# EAGLE design muses72320 (EAGLE 7.2.0)
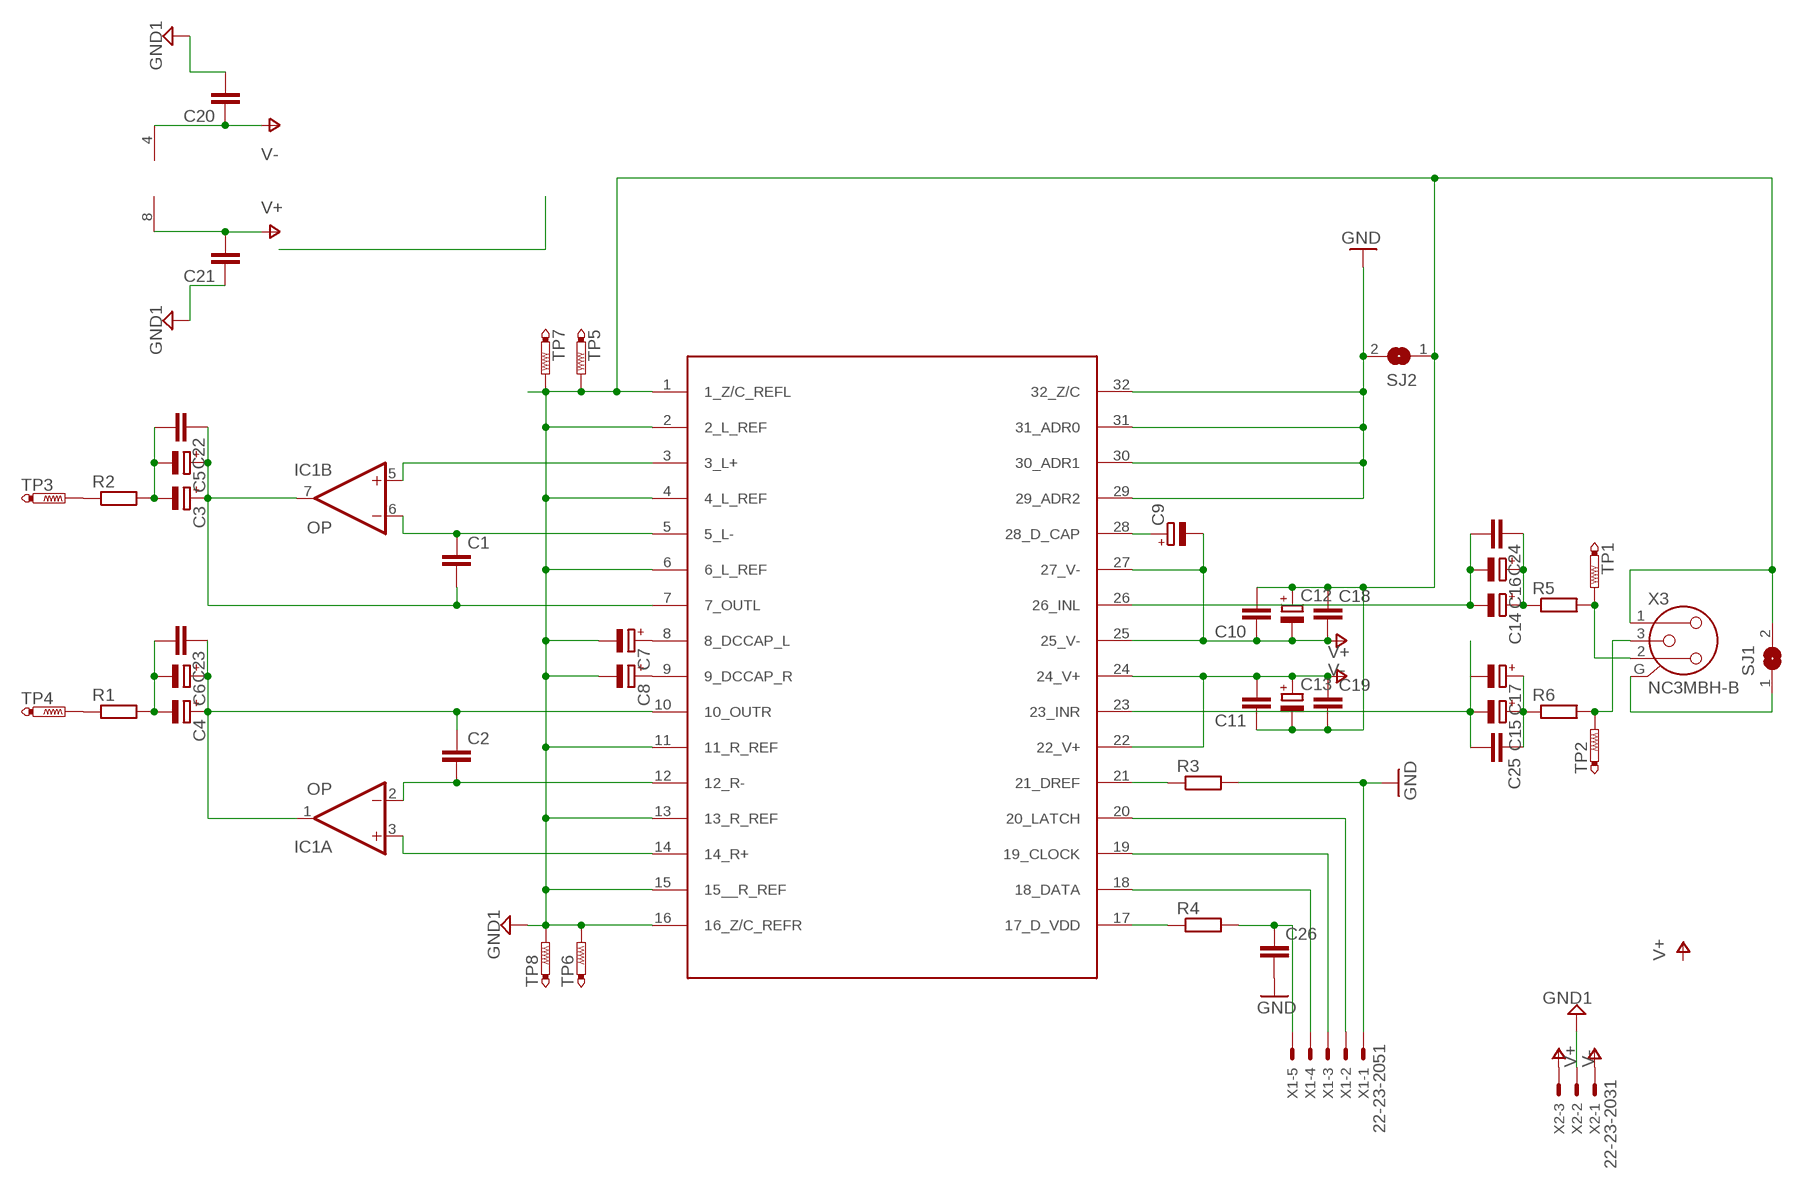
[diagram p0: schematic, sheet 1]

## Parts
C1  C-EU075-032X103  [C075-032X103]
C2  C-EU075-032X103  [C075-032X103]
C3  CPOL-EUE5-10.5  [E5-10,5]
C4  CPOL-EUE5-10.5  [E5-10,5]
C5  CPOL-EUE3.5-8  [E3,5-8]
C6  CPOL-EUE3.5-8  [E3,5-8]
C7  CPOL-EUE5-8.5  [E5-8,5]
C8  CPOL-EUE5-8.5  [E5-8,5]
C9  CPOL-EUE3.5-8  [E3,5-8]
C10  C-EU050-050X075  [C050-050X075]
C11  C-EU050-050X075  [C050-050X075]
C12  CPOL-EUE5-10.5  [E5-10,5]
C13  CPOL-EUE5-10.5  [E5-10,5]
C14  CPOL-EUE3.5-8  [E3,5-8]
C15  CPOL-EUE3.5-8  [E3,5-8]
C16  CPOL-EUE5-10.5  [E5-10,5]
C17  CPOL-EUE5-10.5  [E5-10,5]
C18  C-EU025-030X050  [C025-030X050]
C19  C-EU025-030X050  [C025-030X050]
C20  C-EU050-050X075  [C050-050X075]
C21  C-EU050-050X075  [C050-050X075]
C22  C-EU050-050X075  [C050-050X075]
C23  C-EU050-050X075  [C050-050X075]
C24  C-EU050-050X075  [C050-050X075]
C25  C-EU050-050X075  [C050-050X075]
C26  C-EUC1206  [C1206]
IC1  OP  LM4558N  [DIL08]
R1  R-EU_0207/7  [0207/7]
R2  R-EU_0207/7  [0207/7]
R3  R-EU_R1206  [R1206]
R4  R-EU_R1206  [R1206]
R5  R-EU_0207/7  [0207/7]
R6  R-EU_0207/7  [0207/7]
SJ1  SJ  [SJ]
SJ2  SJ  [SJ]
TP1  PTR1PAD1-20  [P1-20]
TP2  PTR1PAD1-20  [P1-20]
TP3  PTR1PAD1-20  [P1-20]
TP4  PTR1PAD1-20  [P1-20]
TP5  PTR1PAD1-20  [P1-20]
TP6  PTR1PAD1-20  [P1-20]
TP7  PTR1PAD1-20  [P1-20]
TP8  PTR1PAD1-20  [P1-20]
U$1  MUSES72320  [SSOP28DB]
X1  22-23-2051  [22-23-2051]
X2  22-23-2031  [22-23-2031]
X3  NC3MBH-B  [NC3MBH-B]

## Nets
CLOCK: U$1.19(19_CLOCK) X1.3
DATA: U$1.18(18_DATA) X1.4
GND: C26.2 R3.2 SJ2.2 U$1.29(29_ADR2) U$1.30(30_ADR1) U$1.31(31_ADR0) U$1.32(32_Z/C) X1.1
GND1: C7.- C8.- C10.2 C11.1 C12.+ C13.- C18.1 C19.2 C20.2 C21.1 SJ1.2 SJ2.1 TP5.TP TP6.TP TP7.TP TP8.TP U$1.1(1_Z/C_REFL) U$1.2(2_L_REF) U$1.4(4_L_REF) U$1.6(6_L_REF) U$1.11(11_R_REF) U$1.13(13_R_REF) U$1.15(15__R_REF) U$1.16(16_Z/C_REFR) X2.2 X3.1
LATCH: U$1.20(20_LATCH) X1.2
N$2: IC1.3(A:+IN) U$1.14(14_R+)
N$3: C2.2 IC1.2(A:-IN) U$1.12(12_R-)
N$4: C1.1 IC1.6(B:-IN) U$1.5(5_L-)
N$5: IC1.5(B:+IN) U$1.3(3_L+)
N$6: C1.2 C3.+ C5.+ C22.1 IC1.7(B:OUT) U$1.7(7_OUTL)
N$7: C2.1 C4.+ C6.+ C23.1 IC1.1(A:OUT) U$1.10(10_OUTR)
N$8: C3.- C5.- C22.2 R2.2
N$9: C4.- C6.- C23.2 R1.2
N$10: C7.+ U$1.8(8_DCCAP_L)
N$11: C8.+ U$1.9(9_DCCAP_R)
N$12: SJ1.1 X3.G
N$13: R5.2 TP1.TP X3.2
N$14: R6.2 TP2.TP X3.3
N$15: R3.1 U$1.21(21_DREF)
N$16: R4.1 U$1.17(17_D_VDD)
N$17: C9.+ U$1.28(28_D_CAP)
N$19: R2.1 TP3.TP
N$20: R1.1 TP4.TP
N$21: C26.1 R4.2 X1.5
N$23: C15.- C17.- C25.2 U$1.23(23_INR)
N$24: C14.- C16.- C24.2 U$1.26(26_INL)
N$25: C14.+ C16.+ C24.1 R5.1
N$26: C15.+ C17.+ C25.1 R6.1
V+: C11.2 C13.+ C19.1 C21.2 IC1.8(P:V+) U$1.22(22_V+) U$1.24(24_V+) X2.1
V-: C9.- C10.1 C12.- C18.2 C20.1 IC1.4(P:V-) U$1.25(25_V-) U$1.27(27_V-) X2.3

## Library data of the parts
C1 C2 C10 C11 C18-C26 = Vwvwbg:C-EU: CAPACITOR, European symbol
C3-C9 C12-C17 = Vwvwbg:CPOL-EU: POLARIZED CAPACITOR, European symbol
IC1 = linear:*4558: OP AMP
R1-R6 = Vwvwbg:R-EU_: RESISTOR, European symbol
SJ1 SJ2 = jumper:SJ: SMD solder JUMPER
TP1-TP8 = testpad:PTR1: TEST PIN
U$1 = Vwvwbg:MUSES72320
X1 = con-molex:22-23-2051: .100" (2.54mm) Center Header - 5 Pin; MF: MOLEX; MPN: 22-23-2051; OC_FARNELL: 1462952; OC_NEWARK: 38C9178
X2 = con-molex:22-23-2031: .100" (2.54mm) Center Header - 3 Pin; MF: MOLEX; MPN: 22-23-2031; OC_FARNELL: 1462950; OC_NEWARK: 30C0862
X3 = con-neutrik_ag:NC3: Neutrik Audio Connector XLR SERIES Stereo 1/4" jack Source: www.neutrik.com/; MPN: NC3MBH-B; OC_FARNELL: unknown; OC_NEWARK: 27B4288

## Board
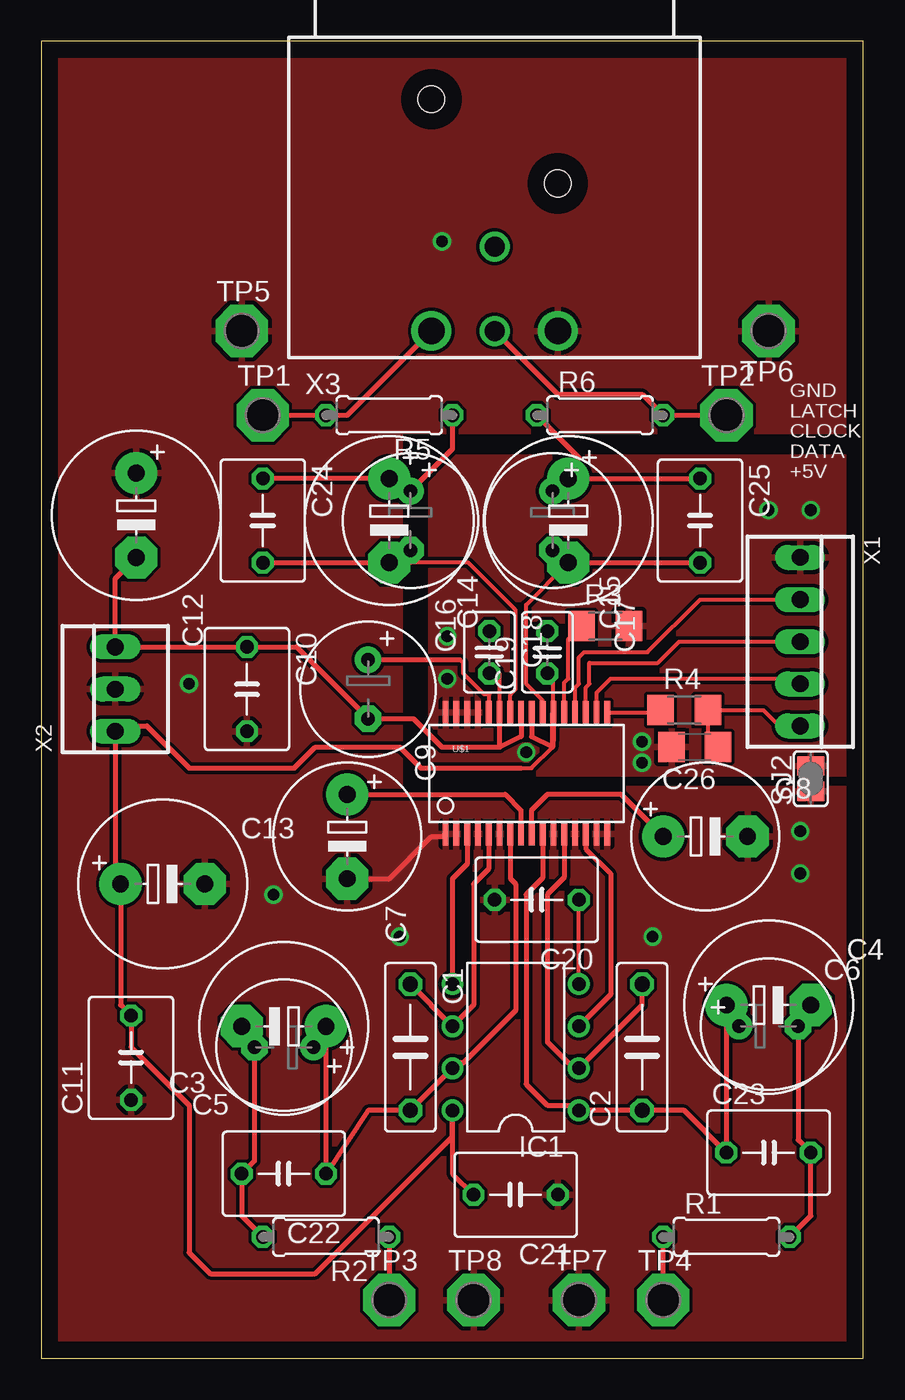
[diagram p1: board, top side]
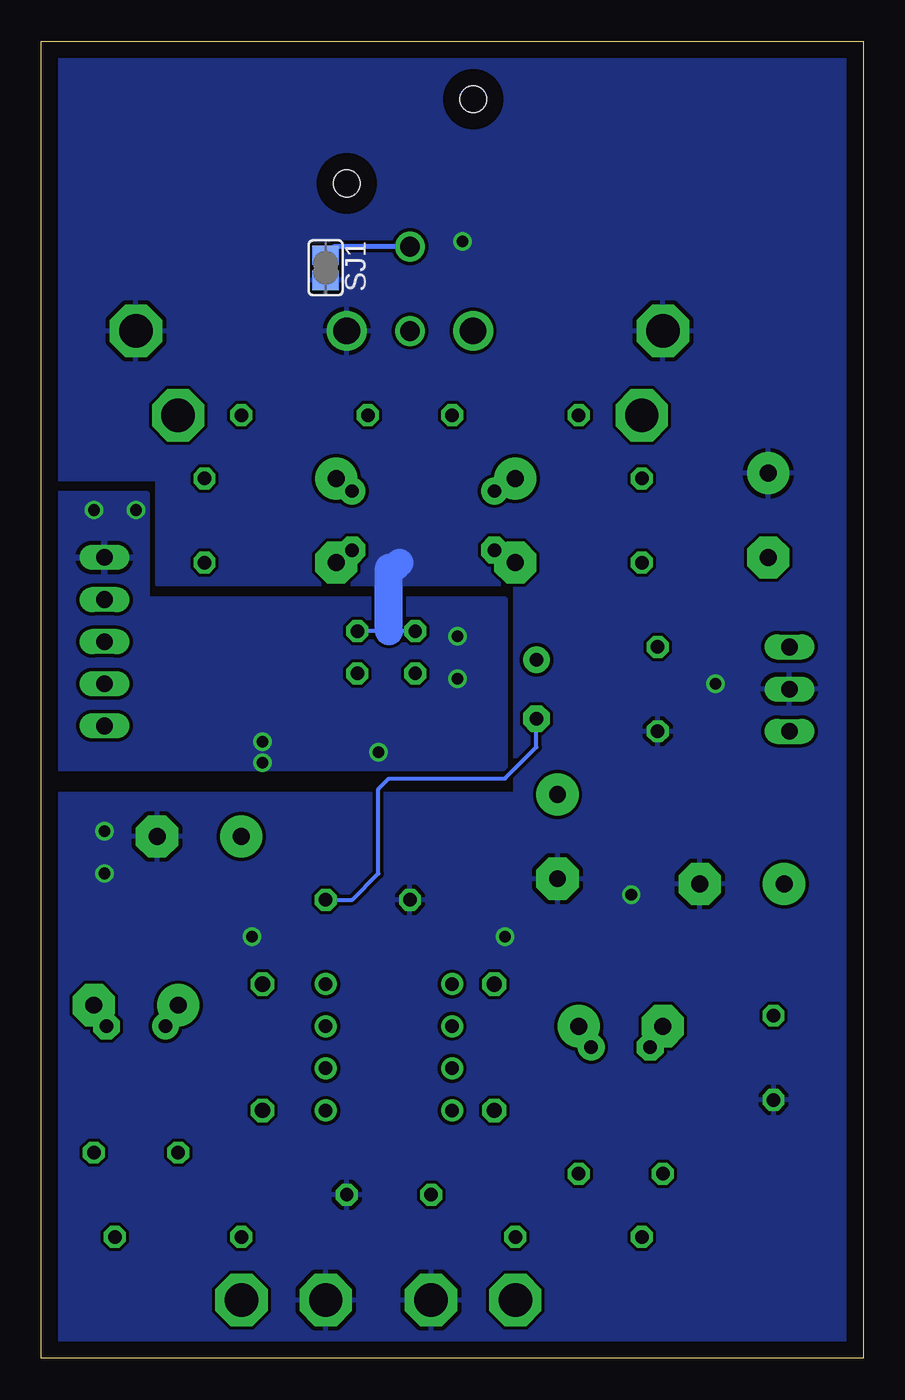
[diagram p2: board, bottom side, seen from below]

Size 49.51 x 79.36 mm. Coordinates in mm from the lower left corner, seen from the top.
Outline: 0,0 49.51,0 49.51,79.36 0,79.36 0,0
Copper layers (1*16): Top 0.035mm / dielectric 1.5mm / Bottom 0.035mm
Design rules "default": minimum track width 10mil, minimum drill 24mil, track to track 8mil, track to pad 8mil, pad to pad 8mil, via to via 8mil, smd to smd 8mil, copper to edge 40mil, drill to drill 8mil, minimum pad ring 10mil, minimum via ring 8mil, stop-mask expansion 4mil, vias tented up to drill 0mil, thermal gap 10mil

### Footprints (pad centres in the part's own frame; a part is rotated, then mirrored left to right if it is on the bottom)
C075-032X103 = drill 0.914 octagon: 1 -3.81,0; 2 3.81,0
E5-10,5 = drill 1.016 pad 2.54: + -2.54,0 | drill 1.016 pad 2.54 octagon: - 2.54,0
E3,5-8 = drill 0.813 pad 1.6: + -1.778,0 | drill 0.813 pad 1.6 octagon: - 1.778,0
E5-8,5 = drill 1.016 pad 2.54: + -2.54,0 | drill 1.016 pad 2.54 octagon: - 2.54,0
C050-050X075 = drill 0.813 octagon: 1 -2.54,0; 2 2.54,0
C025-030X050 = drill 0.813 octagon: 1 -1.27,0; 2 1.27,0
C1206 = smd 1.6 x 1.8: 1 -1.4,0; 2 1.4,0
DIL08 = drill 0.813 pad 1.27: 1 -3.81,-3.81; 2 -1.27,-3.81; 3 1.27,-3.81; 4 3.81,-3.81; 5 3.81,3.81; 6 1.27,3.81; 7 -1.27,3.81; 8 -3.81,3.81
0207/7 = drill 0.813 octagon: 1 -3.81,0; 2 3.81,0
R1206 = smd 1.6 x 1.803: 1 -1.422,0; 2 1.422,0
SJ = smd 1.168 x 1.6: 1 -0.762,0; 2 0.762,0
P1-20 = drill 2.007 pad 3.15 octagon: TP 0,0
SSOP28DB = smd 0.348 x 1.397: 1 -4.225,-3.656; 2 -3.575,-3.656; 3 -2.925,-3.656; 4 -2.275,-3.656; 5 -1.625,-3.656; 6 -0.975,-3.656; 7 -0.325,-3.656; 8 0.325,-3.656; 9 0.975,-3.656; 10 1.625,-3.656; 11 2.275,-3.656; 12 2.925,-3.656; 13 3.575,-3.656; 14 4.225,-3.656; 15 4.875,-3.656; 16 5.525,-3.656; 17 5.525,3.656; 18 4.875,3.656; 19 4.225,3.656; 20 3.575,3.656; 21 2.925,3.656; 22 2.275,3.656; 23 1.625,3.656; 24 0.975,3.656; 25 0.325,3.656; 26 -0.325,3.656; 27 -0.975,3.656; 28 -1.625,3.656; 29 -2.275,3.656; 30 -2.925,3.656; 31 -3.575,3.656; 32 -4.225,3.656
22-23-2051 = drill 1 long: 1 -5.08,0; 2 -2.54,0; 3 0,0; 4 2.54,0; 5 5.08,0
22-23-2031 = drill 1 long: 1 -2.54,0; 2 0,0; 3 2.54,0
NC3MBH-B = drill 1.6: 1 3.81,0; 2 -3.81,0 | drill 1.2: 3 0,0; G 0,5.08 | hole 1.6: -3.81,13.97; 3.81,8.89

### Placement (x,y rotation side)
C1  22.23,18.73 270 top
C2  36.2,18.73 90 top
C3  14.61,20 180 top
C4  43.81,21.27 0 top
C5  14.61,18.73 180 top
C6  43.81,20 0 top
C7  18.41,31.43 270 top
C8  40.01,31.43 0 top
C9  19.68,40.32 270 top
C10  12.38,40.32 270 top
C11  5.4,18.1 90 top
C12  5.71,50.8 270 top
C13  7.3,28.57 0 top
C14  22.23,50.48 270 top
C15  30.8,50.48 270 top
C16  20.95,50.48 270 top
C17  31.75,50.48 270 top
C18  26.99,42.55 270 top
C19  30.48,42.55 90 top
C20  29.84,27.62 180 top
C21  28.57,9.84 180 top
C22  14.61,11.11 180 top
C23  43.81,12.38 0 top
C24  13.34,50.48 270 top
C25  39.69,50.48 270 top
C26  39.37,36.83 180 top
IC1  28.57,18.73 90 top
R1  41.27,7.3 0 top
R2  17.14,7.3 180 top
R3  33.97,44.13 0 top
R4  38.73,39.05 0 top
R5  20.95,56.83 180 top
R6  33.66,56.83 0 top
SJ1  32.38,65.72 270 bottom
SJ2  46.35,34.92 90 top
TP1  13.34,56.83 0 top
TP2  41.27,56.83 0 top
TP3  20.95,3.49 0 top
TP4  37.47,3.49 0 top
TP5  12.06,61.91 0 top
TP6  43.81,61.91 180 top
TP7  32.38,3.49 0 top
TP8  26.04,3.49 0 top
U$1  28.57,35.24 0 top
X1  45.72,43.18 270 top
X2  4.45,40.32 90 top
X3  27.3,61.91 0 top

### Tracks (layer width: path | path; a pad name or v marks a point on that pad's centre or on a via)
CLOCK
  Top 0.254: X1.3 38.42,43.18 37.15,41.91 33.02,41.91 33.02,40.64 32.8,40.42 U$1.19
DATA
  Top 0.254: U$1.18 33.45,40.12 34.29,40.96 45.4,40.96 X1.4
GND  (via drill 0.7)
  other vias: 24.45,40.96 36.2,37.15 43.81,51.12 46.35,51.12 36.2,35.88 24.45,43.5 29.21,36.51
  pour Top: 23.5,54.29 52.7,54.29 52.7,35.24 23.5,35.24
  pour Bottom: 21.59,45.72 43.18,45.72 43.18,52.07 52.07,52.07 52.07,35.56 21.59,35.56
GND1  (via drill 0.7)
  Top 0.305: C7.- 20.95,28.89 23.5,31.43 24.2,31.43 U$1.1
  Bottom 0.254: C18.1 28.57,43.81 C19.2
  Bottom 1.676: 28.57,43.81 28.57,47.62 28.26,47.62 27.94,47.94
  other vias: 45.72,31.75 45.72,29.21 36.83,25.4 21.59,25.4 13.97,27.94 8.89,40.64 24.13,67.31
  pour Bottom: -0.64,82.23 50.16,83.5 50.16,53.02 42.55,53.02 42.55,46.67 20.95,46.67 20.95,33.97 52.7,33.97 52.7,-1.59 -0.64,-2.86
  pour Top: 0,80.01 53.34,80.01 53.34,55.88 21.59,55.88 21.59,34.29 53.34,34.29 53.34,33.02 53.34,-1.27 -1.27,-1.27 -1.27,80.01
LATCH
  Top 0.254: X1.2 39.69,45.72 36.51,42.55 32.7,42.55 32.38,42.23 32.38,40.64 32.15,40.41 U$1.20
N$2
  Top 0.305: U$1.14 32.8,30.7 34.29,29.21 34.29,21.91 IC1.3
N$3
  Top 0.305: C2.2 36.2,21.27 IC1.2 32.07,17.78 31.75,17.78 30.48,19.05 30.48,27.94 31.5,28.96 U$1.12
N$4
  Top 0.305: C1.1 IC1.6 26.04,21.27 26.04,28.57 26.95,29.49 U$1.5
N$5
  Top 0.305: U$1.3 25.65,29.78 24.77,28.89 IC1.5
N$6
  Top 0.305: C5.+ 17.14,20.77 C3.+ C22.1 19.68,14.92 C1.2 IC1.7 25.08,17.78 25.4,17.78 28.57,20.95 28.57,28.57 28.25,28.9 U$1.7
N$7
  Top 0.305: C6.+ 41.27,20.77 C4.+ C23.1 38.73,14.92 C2.1 IC1.1 32.07,15.24 30.48,15.24 29.21,16.51 29.21,27.94 30.2,28.93 U$1.10
N$8
  Top 0.305: C3.- 12.06,20.77 C5.- 12.83,11.87 C22.2 12.06,8.57 R2.2
N$9
  Top 0.305: R1.2 46.35,8.57 C23.2 45.59,13.14 C6.- 46.35,20.77 C4.-
N$10
  Top 0.305: C7.+ 27.94,33.97 28.89,33.02 U$1.8
N$11
  Top 0.305: U$1.9 29.55,33.04 30.48,33.97 34.92,33.97 C8.+
N$12
  Bottom 0.305: X3.G 31.88,66.99 SJ1.1
N$13
  Top 0.305: TP1.TP R5.2 18.41,56.83 X3.2
N$14
  Top 0.305: X3.3 31.11,58.1 36.2,58.1 R6.2 TP2.TP
N$15
  Top 0.254: U$1.21 31.5,40.71 31.75,40.96 31.75,43.33 R3.1
N$16
  Top 0.254: U$1.17 37.16,38.9 R4.1
N$17
  Top 0.254: 26.99,38.94 26.99,40.01 26.67,40.01 25.4,41.27 25.4,41.91 25.21,42.1
  Top 0.305: C9.+ 25.21,42.1 | 26.99,38.94 U$1.28
N$19
  Top 0.305: R2.1 TP3.TP
N$20
  Top 0.305: TP4.TP R1.1
N$21
  Top 0.254: X1.5 44.45,38.1 43.5,39.05 R4.2 40.16,37.44 C26.1
N$23
  Top 0.254: U$1.23 30.2,39.65 29.21,40.64 29.21,45.4 C17.-
  Top 0.305: C25.2 C17.- 31.88,47.94 C15.-
N$24
  Top 0.254: U$1.26 28.25,40 28.57,40.32 28.57,45.09 25.72,47.94 22.23,47.94 21.84,48.32
  Top 0.305: C24.2 C16.- 21.46,47.94 21.84,48.32 C14.-
N$25
  Top 0.305: R5.1 24.77,54.8 C14.+ 21.72,52.26 C16.+ C24.1
N$26
  Top 0.305: C15.+ 31.62,52.26 C17.+ | C17.+ C25.1 | C17.+ 32.38,54.29 R6.1
V+
  Top 0.254: U$1.22 30.85,40.91 C19.1 | 28.89,35.56 29.53,35.56 30.8,36.83 | X2.1 4.76,37.78 5.08,38.1
  Top 0.305: U$1.24 29.55,37.49 29.53,37.47 30.8,36.83 | 30.8,36.83 30.8,38.85 U$1.22 30.85,37.52 30.8,36.83 | X2.1 4.45,28.89 C13.+ 4.76,21.27 C11.2 5.4,18.73 8.89,15.24 8.89,6.35 10.16,5.08 16.51,5.08 24.77,13.34 IC1.8 24.77,11.11 C21.2 | 5.08,38.1 6.35,38.1 8.89,35.56 15.24,35.56 16.51,36.83 21.59,36.83 22.86,35.56 28.89,35.56
V-
  Top 0.254: IC1.4 C20.1 | U$1.27 27.6,41.25 27.01,41.25 C18.2
  Top 0.305: C12.- 4.45,46.99 X2.3 C10.1 15.37,42.86 C9.- 22.42,38.54 24.13,36.83 27.62,36.83 | 27.62,36.83 27.62,38.88 U$1.27 | U$1.25 28.9,37.47 28.89,37.47 27.62,36.83
  Bottom 0.254: C20.1 30.8,27.62 29.21,29.21 29.21,34.29 28.57,34.92 21.59,34.92 19.68,36.83 C9.-

### Text on the board
tPlace: GND / LATCH / CLOCK / DATA / +5V